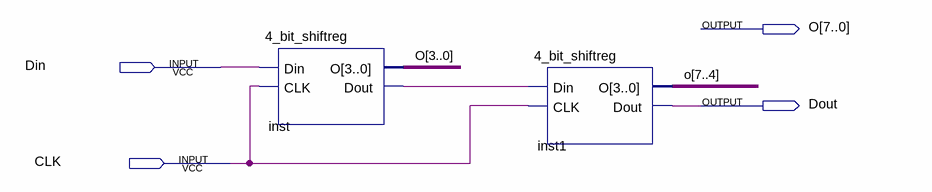
[diagram p0: schematic sheet]
// Quartus schematic 8_bit_shiftreg.bdf as structural Verilog: 2 symbols, 4 pins
module \8_bit_shiftreg  (
  input  Din,
  input  CLK,
  output [7:0] O,
  output Dout
);

  wire inst_dout;

  \4_bit_shiftreg  inst (.Din(Din), .CLK(CLK), .O(O[3:0]), .Dout(inst_dout));
  \4_bit_shiftreg  inst1 (.Din(inst_dout), .CLK(CLK), .O(O[7:4]), .Dout(Dout));
endmodule
